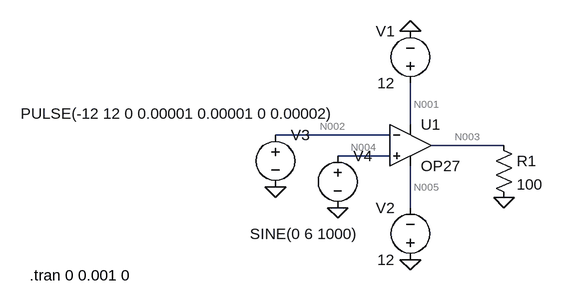
[diagram p0: schematic Draft1.asc]
Draft1.asc, the LTspice schematic file:
Version 4
SHEET 1 880 680
WIRE 160 112 160 48
WIRE 128 128 -48 128
WIRE 304 144 192 144
WIRE 128 160 48 160
WIRE 160 240 160 176
FLAG 160 320 0
FLAG 160 -32 0
FLAG 48 240 0
FLAG -48 208 0
FLAG 304 224 0
SYMBOL voltage 160 64 R180
WINDOW 0 24 96 Left 2
WINDOW 3 24 16 Left 2
WINDOW 123 0 0 Left 0
WINDOW 39 0 0 Left 0
SYMATTR InstName V1
SYMATTR Value 12
SYMBOL voltage 160 336 R180
WINDOW 0 24 96 Left 2
WINDOW 3 24 16 Left 2
WINDOW 123 0 0 Left 0
WINDOW 39 0 0 Left 0
SYMATTR InstName V2
SYMATTR Value 12
SYMBOL voltage -48 112 R0
WINDOW 3 -392 -17 Left 2
WINDOW 123 0 0 Left 0
WINDOW 39 0 0 Left 0
SYMATTR InstName V3
SYMATTR Value PULSE(-12 12 0 0.00001 0.00001 0 0.00002)
SYMBOL voltage 48 144 R0
WINDOW 3 -135 136 Left 2
WINDOW 123 0 0 Left 0
WINDOW 39 0 0 Left 0
SYMATTR InstName V4
SYMATTR Value SINE(0 6 1000)
SYMBOL res 288 128 R0
SYMATTR InstName R1
SYMATTR Value 100
SYMBOL OpAmps\\OP27 160 80 R0
SYMATTR InstName U1
TEXT -426 344 Left 2 !.tran 0 0.001 0

The netlist it stands for:
* Draft1.asc
V1 N001 0 12
V2 0 N005 12
V3 N002 0 PULSE(-12 12 0 0.00001 0.00001 0 0.00002)
V4 N004 0 SINE(0 6 1000)
R1 N003 0 100
XU1 N004 N002 N001 N005 N003 OP27  ; pins In+ In- V+ V- OUT
.tran 0 0.001 0
.lib ADI.lib
.backanno
.end

* Results of the author's LTspice run, read from the files saved beside the schematic
* Operating Point, zero values left out:
*   V(n001) = 12 V
*   V(n005) = -12 V
*   V(n002) = -12 V
*   V(n003) = 3.364 V
*   I(R1) = 33.64 mA
*   I(V1) = -34.9 mA
*   I(V2) = -1.27 mA
*   I(V3) = 55.5 A
*   I(V4) = -55.5 A
*   Ix(u1:1) = 55.5 A
*   Ix(u1:2) = -55.5 A
*   Ix(u1:3) = 34.9 mA
*   Ix(u1:4) = -1.27 mA
*   Ix(u1:5) = -33.64 mA
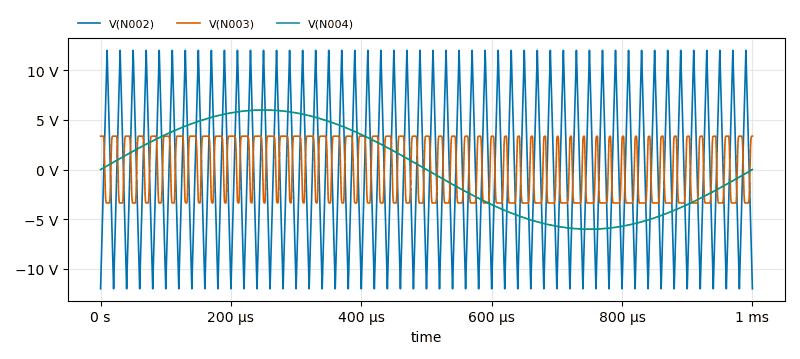
[diagram p1: Transient Analysis of Draft1.asc, plotted from the saved traces]
* Transient Analysis, 1 run:
*   V(N002): min -12 V, max 12 V, average 0 V, rms 7.426 V, last -12 V
*   V(N003): min -3.372 V, max 3.369 V, average 49.49 µV, rms 3.014 V, last 3.364 V
*   V(N004): min -6 V, max 6 V, average -2.051 µV, rms 4.243 V, last 0 V